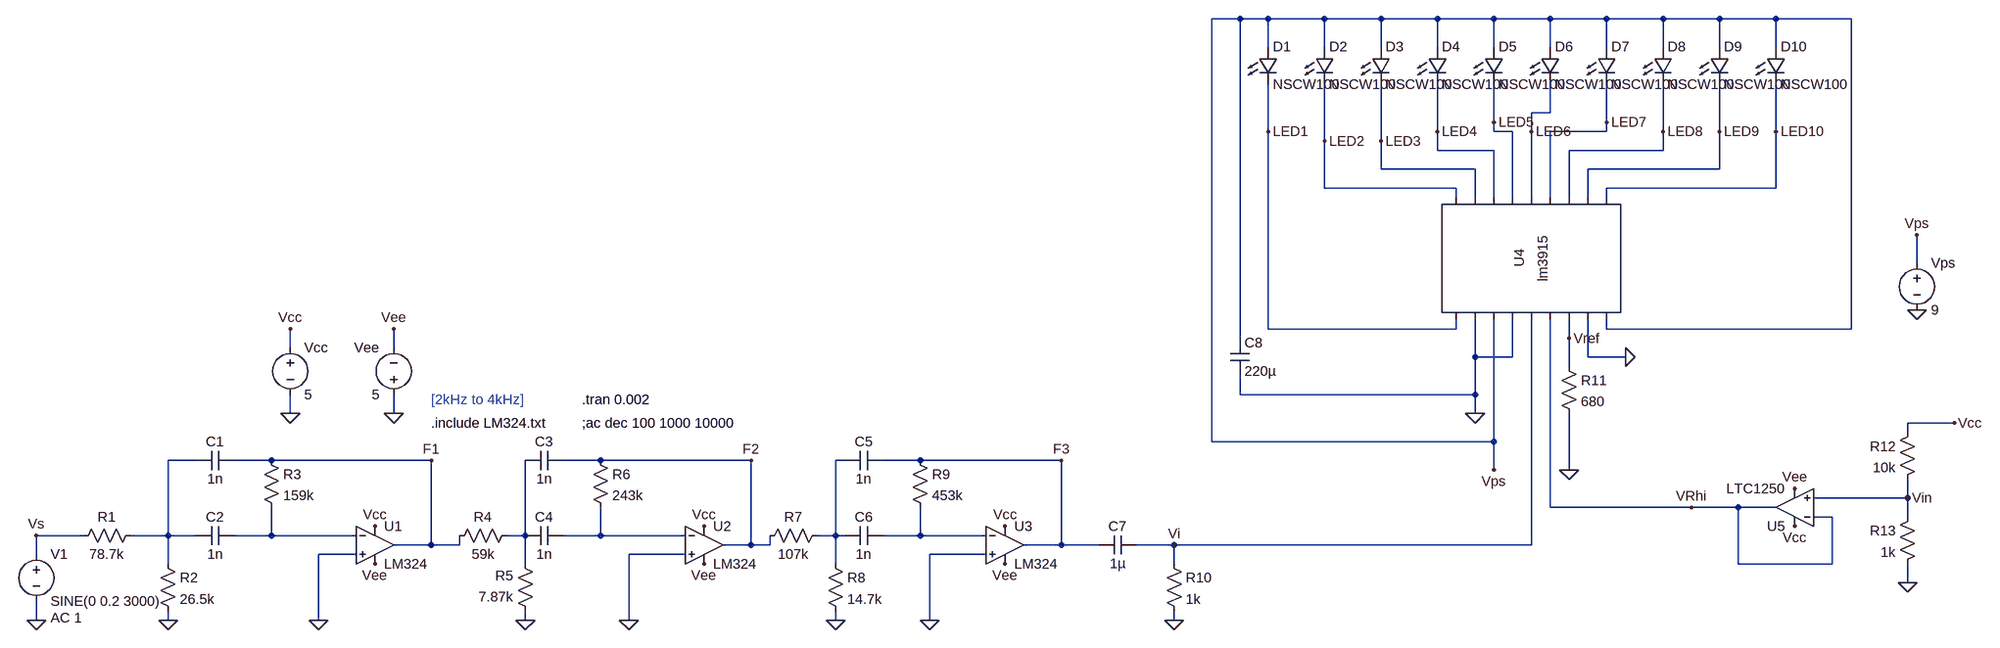
[diagram p0: schematic FinalUpperMidrangeFilterWithLEDDriver.asc]
* FinalUpperMidrangeFilterWithLEDDriver.asc
R1 N001 Vs 78.7k
V1 Vs 0 SINE(0 0.2 3000) AC 1
R3 F1 N003 159k
R4 N004 F1 59k
R5 0 N004 7.87k
R6 F2 N005 243k
R7 F2 N002 107k
R8 N002 0 14.7k
R9 F3 N006 453k
C1 F1 N001 1n
C2 N003 N001 1n
C3 F2 N004 1n
C4 N005 N004 1n
C5 F3 N002 1n
C6 N006 N002 1n
R2 N001 0 26.5k
Vcc Vcc 0 5
Vee 0 Vee 5
XU1 0 N003 Vcc Vee F1 LM324  ; pins In+ In- V+ V- OUT
XU2 0 N005 Vcc Vee F2 LM324  ; pins In+ In- V+ V- OUT
XU3 0 N006 Vcc Vee F3 LM324  ; pins In+ In- V+ V- OUT
C7 Vi F3 1µ
R10 Vi 0 1k
D1 Vps LED1 NSCW100
D2 Vps LED2 NSCW100
D3 Vps LED3 NSCW100
D4 Vps LED4 NSCW100
D5 Vps LED5 NSCW100
D6 Vps LED6 NSCW100
D7 Vps LED7 NSCW100
D8 Vps LED8 NSCW100
D9 Vps LED9 NSCW100
D10 Vps LED10 NSCW100
C8 Vps 0 220µ
Vps Vps 0 9
* U4: lm3915 (symbol AutoGenerated\lm3915 not available, pins judged from their places): pin1=LED1 pin2=0 pin3=Vps pin4=0 pin5=Vi pin6=VRhi pin7=Vref pin8=0 pin9=Vps pin10=LED2 pin11=LED3 pin12=LED4 pin13=LED5 pin14=LED6 pin15=LED7 pin16=LED8 pin17=LED9 pin18=LED10
R11 Vref 0 680
R12 Vcc Vin 10k
R13 Vin 0 1k
XU5 Vin VRhi Vcc Vee VRhi LTC1250  ; pins In+ In- V+ V- OUT
.model D D
.lib standard.dio
.tran 0.002
;ac dec 100 1000 10000
* [2kHz to 4kHz]
.include LM324.txt
.backanno
.end

* Results of the author's LTspice run, read from the files saved beside the schematic
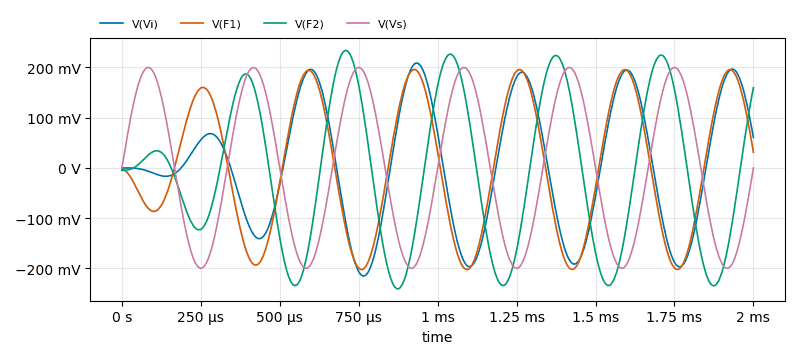
[diagram p1: Transient Analysis of FinalUpperMidrangeFilterWithLEDDriver.asc, plotted from the saved traces]
* Transient Analysis, 1 run:
*   V(Vi): min -215.1 mV, max 208.7 mV, average 4.925 mV, rms 125.9 mV, last 60.4 mV
*   V(F1): min -202.3 mV, max 196.1 mV, average 1.981 mV, rms 133.2 mV, last 31.3 mV
*   V(F2): min -240.6 mV, max 234 mV, average -9.107 mV, rms 149 mV, last 159.6 mV
*   V(Vs): min -200 mV, max 200 mV, average 19.15 µV, rms 141.4 mV, last 0 V